# EAGLE design weight_sens (EAGLE 6.4)
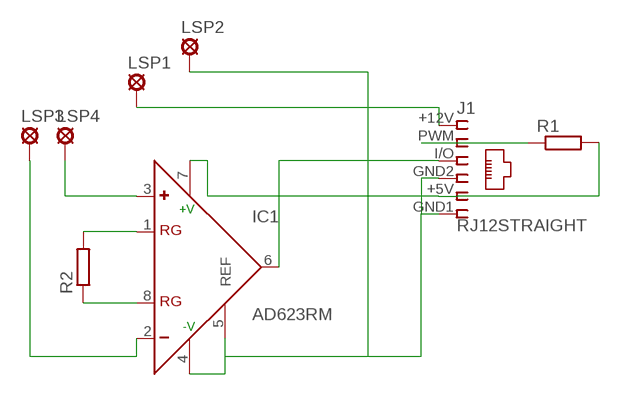
[diagram p0: schematic, sheet 1]

## Parts
IC1  AD623RM  [MSOP08]
J1  RJ12STRAIGHT  [RJ12-STRAIGHT]
LSP1  LSP10  [LSP10]
LSP2  LSP10  [LSP10]
LSP3  LSP10  [LSP10]
LSP4  LSP10  [LSP10]
R1  R-EU_M1206  [M1206]
R2  R-EU_R1206  [R1206]

## Nets
N$1: IC1.1(RG) R2.2
N$2: IC1.8(RG) R2.1
N$3: IC1.6(OUT) J1.I/O
N$4: IC1.2(-) LSP3.MP
N$5: IC1.7(+V) J1.+5V R1.2
N$6: IC1.4(-V) IC1.5(REF) J1.GND1 J1.GND2 LSP2.MP
N$7: J1.+12V LSP1.MP
N$8: IC1.3(+) LSP4.MP
N$10: J1.PWM R1.1

## Library data of the parts
IC1 = analog-devices:AD623: Single-Supply, Rail-to-Rail, Low Cost Instrumentation Amplifier Source: http://www.analog.com/static/imported-files/data_sheets/AD623.pdf; MPN: AD623ARMZ; OC_FARNELL: 1660961; OC_NEWARK: 19M8824
J1 = lpatiny:RJ12: CORCOM Modular RJ Jacks No Shield Source: www.tycoelectronics.com .. ENG_DS_1654001_1099_RJ_L_0507.pdf
LSP1-LSP4 = solpad:LSP10: SOLDER PAD drill 1.0 mm, distributor Buerklin, 12H555
R1 = rcl:R-EU_: RESISTOR, European symbol
R2 = resistor:R-EU_: RESISTOR, European symbol

## Board
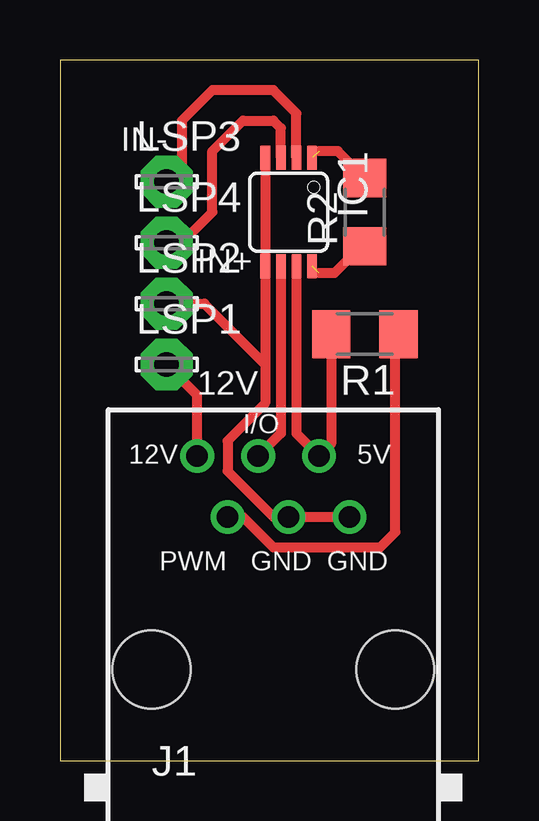
[diagram p1: board, top side]

Size 17.45 x 29.2 mm. Coordinates in mm from the lower left corner, seen from the top.
Outline: 0,0 17.45,0 17.45,29.2 0,29.2 0,0
Copper layers (1*16): Top 0.035mm / dielectric 1.5mm / Bottom 0.035mm
Design rules "default": minimum track width 10mil, minimum drill 24mil, track to track 8mil, track to pad 8mil, pad to pad 8mil, via to via 8mil, smd to smd 8mil, copper to edge 40mil, drill to drill 8mil, minimum pad ring 10mil, minimum via ring 8mil, stop-mask expansion 4mil, vias tented up to drill 0mil, thermal gap 10mil

### Footprints (pad centres in the part's own frame; a part is rotated, then mirrored left to right if it is on the bottom)
MSOP08 = smd 0.4 x 1: 1 -0.976,-2.263; 2 -0.326,-2.263; 3 0.324,-2.263; 4 0.974,-2.263; 5 0.974,2.262; 6 0.324,2.262; 7 -0.326,2.262; 8 -0.976,2.262
RJ12-STRAIGHT = drill 0.9 pad 1.4: +5V 1.905,8.89; +12V -3.175,8.89; GND1 3.175,6.35; GND2 0.635,6.35; I/O -0.635,8.89; PWM -1.905,6.35 | hole 3.251: -5.08,0; 5.08,0
LSP10 = drill 1.016 pad 2.159 octagon: MP 0,0
M1206 = smd 1.6 x 2: 1 -1.4,0; 2 1.4,0
R1206 = smd 1.6 x 1.803: 1 -1.422,0; 2 1.422,0

### Placement (x,y rotation side)
IC1  9.53,22.86 180 top
J1  8.89,3.81 0 top
LSP1  4.45,16.51 0 top
LSP2  4.45,19.05 0 top
LSP3  4.45,24.13 0 top
LSP4  4.45,21.59 0 top
R1  12.7,17.78 180 top
R2  12.7,22.86 90 top

### Tracks (layer width: path | path; a pad name or v marks a point on that pad's centre or on a via)
N$1  (1 unrouted)
  Top 0.406: R2.2 11.58,25.4 10.79,25.4
N$2  (1 unrouted)
  Top 0.406: R2.1 12.85,21.59 12.7,21.59 11.43,20.32 10.79,20.32
N$3
  Top 0.406: IC1.6 9.2,13.65 J1.I/O
N$4
  Top 0.406: IC1.2 9.85,26.98 8.89,27.94 6.35,27.94 5.08,26.67 5.08,24.77 LSP3.MP
N$5
  Top 0.406: IC1.7 9.85,13.64 J1.+5V 11.3,13.21 R1.2
N$6
  Top 0.406: IC1.4 IC1.5 8.55,16.51 | J1.GND1 J1.GND2 8.89,10.16 6.99,12.06 6.99,13.34 8.55,14.9 8.55,16.51 | LSP2.MP 6.01,19.05 8.55,16.51
N$7
  Top 0.406: J1.+12V 5.71,15.24 LSP1.MP
N$8
  Top 0.406: IC1.3 9.2,26.36 8.89,26.67 7.62,26.67 6.35,25.4 6.35,22.86 5.08,21.59 LSP4.MP
N$10
  Top 0.406: J1.PWM 7.62,10.16 8.89,8.89 13.34,8.89 13.97,9.53 13.97,17.65 R1.1

### Text on the board
tSilk: IN- | IN+ | 12V